# Altium schematic sheet 1_interface.schdoc: Interface
size A3; DrawnBy: André M. P. Mattos; SheetNumber: 1; SheetTotal: 6; DesignedBy: André M. P. Mattos; ProjectRevision: v0.1; Rule: PcbType=ProtelPcb
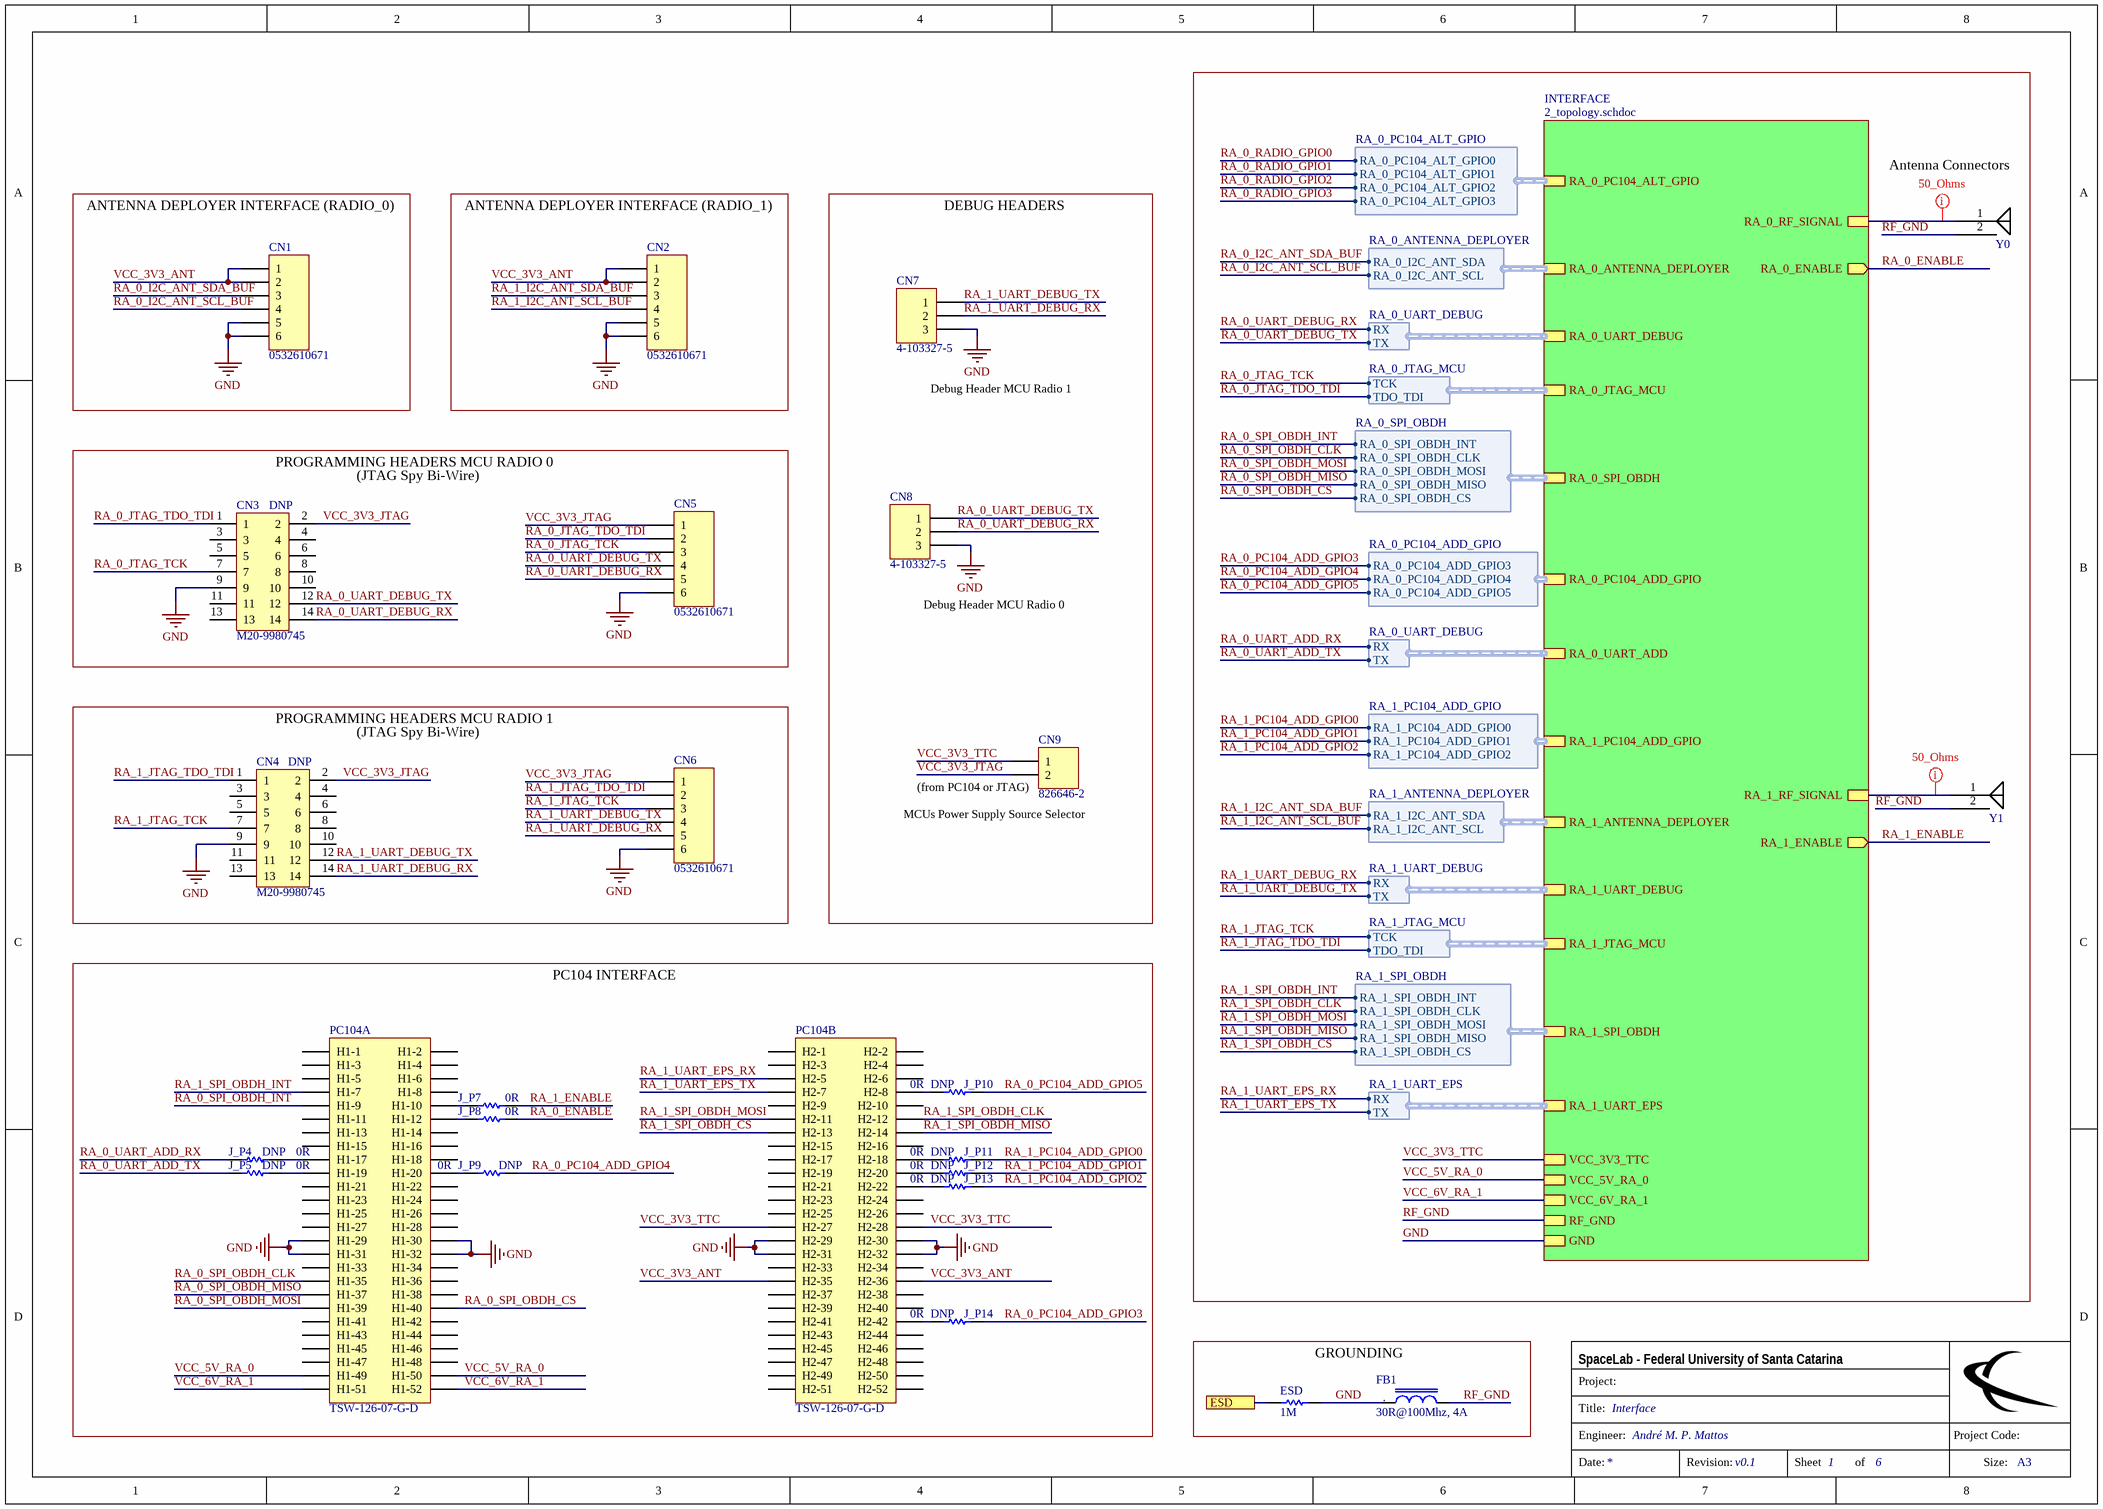
[diagram p0: 1_interface.schdoc]

## Parts
CN1  0532610671  [PICOBLADE 6PIN Right Angle]
CN2  0532610671  [PICOBLADE 6PIN Right Angle]
CN3  M20-9980745  [CONN HEADER VERT 14POS 2.54MM]
CN4  M20-9980745  [CONN HEADER VERT 14POS 2.54MM]
CN5  0532610671  [PICOBLADE 6PIN Right Angle]
CN6  0532610671  [PICOBLADE 6PIN Right Angle]
CN7  4-103327-5  [HDR 1X3]
CN8  4-103327-5  [HDR 1X3]
CN9  826646-2  [HDR 1X2]
ESD  1M  [0805]
FB1  30R@100Mhz, 4A  [IND0805]
J_P4  0R  [0805]
J_P5  0R  [0805]
J_P7  0R  [0805]
J_P8  0R  [0805]
J_P9  0R  [0805]
J_P10  0R  [0805]
J_P11  0R  [0805]
J_P12  0R  [0805]
J_P13  0R  [0805]
J_P14  0R  [0805]
PC104  TSW-126-07-G-D  [PC104_TTC]  (parts A,B of 2)
Y0  Coaxial_Connectors_90º  [CONN MCX JACK  R/A  50 OHM SMD]  (value not drawn)
Y1  Coaxial_Connectors_90º  [CONN MCX JACK  R/A  50 OHM SMD]  (value not drawn)

## Blocks framed on the sheet
Antenna Connectors: Y0 Y1
ANTENNA DEPLOYER INTERFACE (RADIO_0): CN1
ANTENNA DEPLOYER INTERFACE (RADIO_1): CN2
DEBUG HEADERS: CN7-CN9
PC104 INTERFACE: J_P4 J_P5 J_P7-J_P14 PC104
GROUNDING: ESD FB1

## Sub-sheets
INTERFACE = 2_topology.schdoc: RA_0_ANTENNA_DEPLOYER (harness RA_0_ANTENNA_DEPLOYER), RA_0_UART_DEBUG (harness RA_0_UART_DEBUG), RA_0_JTAG_MCU (harness RA_0_JTAG_MCU), RA_0_PC104_ALT_GPIO (harness RA_0_PC104_ALT_GPIO), RA_0_PC104_ADD_GPIO (harness RA_0_PC104_ADD_GPIO), RA_0_UART_ADD (harness RA_0_UART_DEBUG), RA_1_ANTENNA_DEPLOYER (harness RA_1_ANTENNA_DEPLOYER), RA_1_UART_DEBUG (harness RA_1_UART_DEBUG), RA_1_JTAG_MCU (harness RA_1_JTAG_MCU), RA_1_SPI_OBDH (harness RA_1_SPI_OBDH), RA_1_PC104_ADD_GPIO (harness RA_1_PC104_ADD_GPIO), RA_1_UART_EPS (harness RA_1_UART_EPS), RA_0_RF_SIGNAL, RA_1_RF_SIGNAL, RA_0_ENABLE (out), RA_1_ENABLE (out), VCC_3V3_TTC, VCC_5V_RA_0, VCC_6V_RA_1, RF_GND, GND, RA_0_SPI_OBDH (harness RA_0_SPI_OBDH)

## Ports
ESD

## Harnesses
RA_0_PC104_ALT_GPIO: RA_0_PC104_ALT_GPIO3, RA_0_PC104_ALT_GPIO2, RA_0_PC104_ALT_GPIO1, RA_0_PC104_ALT_GPIO0
RA_0_ANTENNA_DEPLOYER: RA_0_I2C_ANT_SCL, RA_0_I2C_ANT_SDA
RA_0_UART_DEBUG: TX, RX
RA_0_JTAG_MCU: TDO_TDI, TCK
RA_1_PC104_ADD_GPIO: RA_1_PC104_ADD_GPIO2, RA_1_PC104_ADD_GPIO1, RA_1_PC104_ADD_GPIO0
RA_1_ANTENNA_DEPLOYER: RA_1_I2C_ANT_SCL, RA_1_I2C_ANT_SDA
RA_1_UART_DEBUG: TX, RX
RA_1_JTAG_MCU: TDO_TDI, TCK
RA_1_SPI_OBDH: RA_1_SPI_OBDH_CLK, RA_1_SPI_OBDH_MOSI, RA_1_SPI_OBDH_MISO, RA_1_SPI_OBDH_CS, RA_1_SPI_OBDH_INT
RA_1_UART_EPS: TX, RX
RA_0_PC104_ADD_GPIO: RA_0_PC104_ADD_GPIO5, RA_0_PC104_ADD_GPIO4, RA_0_PC104_ADD_GPIO3
RA_0_SPI_OBDH: RA_0_SPI_OBDH_CLK, RA_0_SPI_OBDH_MOSI, RA_0_SPI_OBDH_MISO, RA_0_SPI_OBDH_CS, RA_0_SPI_OBDH_INT

## Nets
GND: CN1.5 CN1.6 CN2.5 CN2.6 CN3.9 CN4.9 CN5.6 CN6.6 CN7.3 CN8.3 ESD.1 FB1.1 PC104.H1-29 PC104.H1-30 PC104.H1-31 PC104.H1-32 PC104.H2-29 PC104.H2-30 PC104.H2-31 PC104.H2-32 ; sheet INTERFACE/GND
ESD: ESD.2 ; port ESD
RA_0_ENABLE: J_P8.1 ; sheet INTERFACE/RA_0_ENABLE
RA_0_I2C_ANT_SCL_BUF: CN1.4 ; sheet INTERFACE/RA_0_ANTENNA_DEPLOYER.RA_0_I2C_ANT_SCL
RA_0_I2C_ANT_SDA_BUF: CN1.3 ; sheet INTERFACE/RA_0_ANTENNA_DEPLOYER.RA_0_I2C_ANT_SDA
RA_0_JTAG_TCK: CN3.7 CN5.3 ; sheet INTERFACE/RA_0_JTAG_MCU.TCK
RA_0_JTAG_TDO_TDI: CN3.1 CN5.2 ; sheet INTERFACE/RA_0_JTAG_MCU.TDO_TDI
RA_0_PC104_ADD_GPIO3: J_P14.1 ; sheet INTERFACE/RA_0_PC104_ADD_GPIO.RA_0_PC104_ADD_GPIO3
RA_0_PC104_ADD_GPIO4: J_P9.1 ; sheet INTERFACE/RA_0_PC104_ADD_GPIO.RA_0_PC104_ADD_GPIO4
RA_0_PC104_ADD_GPIO5: J_P10.1 ; sheet INTERFACE/RA_0_PC104_ADD_GPIO.RA_0_PC104_ADD_GPIO5
RA_0_RADIO_GPIO0: sheet INTERFACE/RA_0_PC104_ALT_GPIO.RA_0_PC104_ALT_GPIO0
RA_0_RADIO_GPIO1: sheet INTERFACE/RA_0_PC104_ALT_GPIO.RA_0_PC104_ALT_GPIO1
RA_0_RADIO_GPIO2: sheet INTERFACE/RA_0_PC104_ALT_GPIO.RA_0_PC104_ALT_GPIO2
RA_0_RADIO_GPIO3: sheet INTERFACE/RA_0_PC104_ALT_GPIO.RA_0_PC104_ALT_GPIO3
RA_0_SPI_OBDH_CLK: PC104.H1-35 ; sheet INTERFACE/RA_0_SPI_OBDH.RA_0_SPI_OBDH_CLK
RA_0_SPI_OBDH_CS: PC104.H1-40 ; sheet INTERFACE/RA_0_SPI_OBDH.RA_0_SPI_OBDH_CS
RA_0_SPI_OBDH_INT: PC104.H1-9 ; sheet INTERFACE/RA_0_SPI_OBDH.RA_0_SPI_OBDH_INT
RA_0_SPI_OBDH_MISO: PC104.H1-37 ; sheet INTERFACE/RA_0_SPI_OBDH.RA_0_SPI_OBDH_MISO
RA_0_SPI_OBDH_MOSI: PC104.H1-39 ; sheet INTERFACE/RA_0_SPI_OBDH.RA_0_SPI_OBDH_MOSI
RA_0_UART_ADD_RX: J_P4.2 ; sheet INTERFACE/RA_0_UART_ADD.RX
RA_0_UART_ADD_TX: J_P5.2 ; sheet INTERFACE/RA_0_UART_ADD.TX
RA_0_UART_DEBUG_RX: CN3.14 CN5.5 CN8.2 ; sheet INTERFACE/RA_0_UART_DEBUG.RX
RA_0_UART_DEBUG_TX: CN3.12 CN5.4 CN8.1 ; sheet INTERFACE/RA_0_UART_DEBUG.TX
RA_1_ENABLE: J_P7.1 ; sheet INTERFACE/RA_1_ENABLE
RA_1_I2C_ANT_SCL_BUF: CN2.4 ; sheet INTERFACE/RA_1_ANTENNA_DEPLOYER.RA_1_I2C_ANT_SCL
RA_1_I2C_ANT_SDA_BUF: CN2.3 ; sheet INTERFACE/RA_1_ANTENNA_DEPLOYER.RA_1_I2C_ANT_SDA
RA_1_JTAG_TCK: CN4.7 CN6.3 ; sheet INTERFACE/RA_1_JTAG_MCU.TCK
RA_1_JTAG_TDO_TDI: CN4.1 CN6.2 ; sheet INTERFACE/RA_1_JTAG_MCU.TDO_TDI
RA_1_PC104_ADD_GPIO0: J_P11.1 ; sheet INTERFACE/RA_1_PC104_ADD_GPIO.RA_1_PC104_ADD_GPIO0
RA_1_PC104_ADD_GPIO1: J_P12.1 ; sheet INTERFACE/RA_1_PC104_ADD_GPIO.RA_1_PC104_ADD_GPIO1
RA_1_PC104_ADD_GPIO2: J_P13.1 ; sheet INTERFACE/RA_1_PC104_ADD_GPIO.RA_1_PC104_ADD_GPIO2
RA_1_SPI_OBDH_CLK: PC104.H2-12 ; sheet INTERFACE/RA_1_SPI_OBDH.RA_1_SPI_OBDH_CLK
RA_1_SPI_OBDH_CS: PC104.H2-13 ; sheet INTERFACE/RA_1_SPI_OBDH.RA_1_SPI_OBDH_CS
RA_1_SPI_OBDH_INT: PC104.H1-7 ; sheet INTERFACE/RA_1_SPI_OBDH.RA_1_SPI_OBDH_INT
RA_1_SPI_OBDH_MISO: PC104.H2-14 ; sheet INTERFACE/RA_1_SPI_OBDH.RA_1_SPI_OBDH_MISO
RA_1_SPI_OBDH_MOSI: PC104.H2-11 ; sheet INTERFACE/RA_1_SPI_OBDH.RA_1_SPI_OBDH_MOSI
RA_1_UART_DEBUG_RX: CN4.14 CN6.5 CN7.2 ; sheet INTERFACE/RA_1_UART_DEBUG.RX
RA_1_UART_DEBUG_TX: CN4.12 CN6.4 CN7.1 ; sheet INTERFACE/RA_1_UART_DEBUG.TX
RA_1_UART_EPS_RX: PC104.H2-5 ; sheet INTERFACE/RA_1_UART_EPS.RX
RA_1_UART_EPS_TX: PC104.H2-7 ; sheet INTERFACE/RA_1_UART_EPS.TX
RF_GND: FB1.2 Y0.2 Y1.2 ; sheet INTERFACE/RF_GND
VCC_3V3_ANT: CN1.1 CN1.2 CN2.1 CN2.2 PC104.H2-35 PC104.H2-36
VCC_3V3_JTAG: CN3.2 CN4.2 CN5.1 CN6.1 CN9.2
VCC_3V3_TTC: CN9.1 PC104.H2-27 PC104.H2-28 ; sheet INTERFACE/VCC_3V3_TTC
VCC_5V_RA_0: PC104.H1-49 PC104.H1-50 ; sheet INTERFACE/VCC_5V_RA_0
VCC_6V_RA_1: PC104.H1-51 PC104.H1-52 ; sheet INTERFACE/VCC_6V_RA_1
NetJ_P4_1: J_P4.1 PC104.H1-17
NetJ_P5_1: J_P5.1 PC104.H1-19
NetJ_P7_2: J_P7.2 PC104.H1-10
NetJ_P8_2: J_P8.2 PC104.H1-12
NetJ_P9_2: J_P9.2 PC104.H1-20
NetJ_P10_2: J_P10.2 PC104.H2-8
NetJ_P11_2: J_P11.2 PC104.H2-18
NetJ_P12_2: J_P12.2 PC104.H2-20
NetJ_P13_2: J_P13.2 PC104.H2-22
NetJ_P14_2: J_P14.2 PC104.H2-42
NetY0_1: Y0.1 ; sheet INTERFACE/RA_0_RF_SIGNAL
NetY1_1: Y1.1 ; sheet INTERFACE/RA_1_RF_SIGNAL

Not connected (* = marked no-connect by the designer): CN3 3 4 5 6 8 10 11 13; CN4 3 4 5 6 8 10 11 13; PC104 H1-1 H1-2 H1-3 H1-4 H1-5 H1-6 H1-8 H1-11 H1-13 H1-14 H1-15 H1-16 H1-18 H1-21 H1-22 H1-23 H1-24 H1-25 H1-26 H1-27 H1-28 H1-33 H1-34 H1-36 H1-38 H1-41 H1-42 H1-43 H1-44 H1-45 H1-46 H1-47 H1-48 H2-1 H2-2 H2-3 H2-4 H2-6 H2-9 H2-10 H2-15 H2-16 H2-17 H2-19 H2-21 H2-23 H2-24 H2-25 H2-26 H2-33 H2-34 H2-37 H2-38 H2-39 H2-40 H2-41 H2-43 H2-44 H2-45 H2-46 H2-47 H2-48 H2-49 H2-50 H2-51 H2-52

## Layout directives
net class 50Ohm_Net: NetY0_1, NetY1_1

## Notes on the sheet
- Debug Header MCU Radio 1
- (near CN3) DNP
- (near CN3) PROGRAMMING HEADERS MCU RADIO 0
- (JTAG Spy Bi-Wire)
- Debug Header MCU Radio 0
- (near CN4) PROGRAMMING HEADERS MCU RADIO 1
- (near CN4) DNP
- (near CN9) MCUs Power Supply Source Selector
- (near CN9) (from PC104 or JTAG)
- (near J_P10) DNP
- (near J_P4) DNP
- DNP
- (near J_P9) DNP
- (near J_P11) DNP
- (near J_P14) DNP
- Project:
- SpaceLab - Federal University of Santa Catarina
- Title:
- Engineer:
- Project Code:
- Date:
- Revision:
- Sheet
- of
- Size:
- A3
- (in symbol FB_30R_4A_100MHz_0805) .

## Library data of the parts
CN1 CN2 CN5 CN6 = 0532610671: PicoBlade 6 Position Right Angle Connector Header Surface Mount  0.049" (1.25mm); LatestRevisionDate: 17-Jul-2002; LatestRevisionNote: Re-released for DXP Platform.; Publisher: Altium Limited; Partnumber: 0532610671
CN3 CN4 = M20-9980745: Connector Header Through Hole 14 position 0.100" (2.54mm); Manufacturer: Harwin; Number of Contacts: 14; Contact Resistance: 25mR; Max Current Rating: 3A; Gender: Male; Connector Type: Male Pin; Row Spacing: 0.1inch; Supplier 1: Digi-Key; Supplier Part Number 1: 952-1932-ND; Stock 1: 15564; Pricing 1: 1=0.54, 10=0.51, 100=0.391, 500=0.34, 1000=0.2805, 5000=0.2465, 10000=0.2295 (USD); Mount: Through Hole; Contact Plating: Gold; Contact Material: Brass; Color: Black; Housing Color: Black; Housing Material: Nylon; Min Operating Temperature: -40°C; Max Operating Temperature: 105°C; Number of Rows: 2; Termination: Solder; Package Quantity: 500; Packaging: Bag; Number of Positions: 14; Orientation: Straight; Length: 17.78mm; Pitch: 2.54mm; Contact Mating Length: 0.24inch; Depth: 5.08mm; Radiation Hardening: No; REACH SVHC: No SVHC; ComponentLink1URL: https://www.verical.com/server-webapp/html/getDatasheet?partID=468550&src-supplier=Verical; ComponentLink1Description: https://www.verical.com/server-webapp/html/getDatasheet?partID=468550&src-supplier=Verical; ComponentLink2URL: http://www.harwin.com/include/downloads/drawings/M20-998.PDF?src-supplier=Element14; ComponentLink2Description: http://www.harwin.com/include/downloads/drawings/M20-998.PDF?src-supplier=Element14; ComponentLink3URL: http://www.mouser.com/ds/2/181/M20-998-351176.pdf?src-supplier=Mouser; ComponentLink3Description: http://www.mouser.com/ds/2/181/M20-998-351176.pdf?src-supplier=Mouser; Supplier 2: Mouser; Supplier Part Number 2: 855-M20-9980745; Stock 2: 1790; Pricing 2: 1=0.54, 10=0.51, 100=0.387, 500=0.34, 1000=0.28, 2500=0.246 (USD); Manufacturer Part Number: M20-9980745
CN7 CN8 = 4-103327-5: Connector Header Through Hole 3 position 0.100" (2.54mm); Manufacturer: TE Connectivity AMP; Number of Contacts: 3; Connector Type: Plug,Header,Pin; Current Rating: 3A; Insulation Resistance: 5GR; Board Standoff: No (Without); High Speed Serial Data Connector: No; PCB Mount Retention: Without; PCB Mounting Orientation: Vertical; Contact Post Length: 0.12inch; Approvals: CSA; Fitted: Yes (eng model only); LatestRevisionDate: 17-Jul-2002; LatestRevisionNote: Re-released for DXP Platform.; Publisher: Altium Limited; Partnumber: 4-103327-5; Supplier 1: Mouser; Supplier Part Number 1: 571-4-103327-5; Stock 1: 2961; Pricing 1: 1=0.26, 10=0.182, 100=0.157, 500=0.15, 1000=0.125, 2500=0.107 (USD); Mount: Through Hole; Contact Plating: Tin; Contact Material: Bronze; Housing Color: Black; Housing Material: Thermoplastic; Contact Shape: Square; Min Operating Temperature: -65°C; Max Operating Temperature: 105°C; Number of Rows: 1; Termination: Through Hole; Packaging: Carton; Package Quantity: 540; Number of Positions: 3; Contact Gender: Male; Orientation: Straight; Contact Protection: No (Without); Gasket: No (Without); High Temperature Housing: No; Keyed: No; Mating Connector Lock: No (Without); Selectively Loaded: No (Without); Stabilizers: No (Without); Strain Relief: No (Without); Contact Current Rating: 3A; Length: 7.21mm; Pitch: 2.54mm; Contact Mating Length: 0.23inch; Row Spacing: 2.54mm; Depth: 2.34mm; Radiation Hardening: No; ELV: Compliant; Flammability Rating: UL94 V-0; Supplier 2: Digi-Key; Supplier Part Number 2: A128778-ND; Stock 2: 16328; Pricing 2: 1=0.26, 10=0.25, 100=0.1753, 500=0.1503, 1000=0.12525, 5000=0.10736, 10000=0.1002 (USD); Manufacturer Part Number: 4-103327-5
CN9 = 826646-2: Connector Header Through Hole 2 position 0.100" (2.54mm); LatestRevisionDate: 17-Jul-2002; LatestRevisionNote: Re-released for DXP Platform.; Publisher: Altium Limited; PartNumber: 826646-2
ESD = R1000k_1%_1/8W_0805: RES 1000K OHM 1/8W 1% 0805; Partnumber: RMCF0805FG1M00; NCM: 8533.21.20
FB1 = FB_30R_4A_100MHz_0805: Ferrite Bead 30 OHM 4A 100MHz; Partnumber: BLM21PG300SN1D; NCM: 8504.50.00
J_P4 J_P5 J_P7-J_P14 = R0R_JUMPER_1/8W_0805: RES 0R OHM 1/8W JUMPER 0805; Partnumber: CRCW08050000Z0EA; NCM: 8533.21.20
PC104 = PC104_TTC: Connector Header Through Hole 52 position 0.100" (2.54mm) - PC104 used in the TTC module; Partnumber: SSW-126-04-G-D; Contact Length - Mating: 5.84mm; Overall Contact Length: 10.92mm; Contact Length - Post: 2.54mm; Insulation Height: 2.54mm; Contact Finish - Mating: Gold; Operating Temperature: -55°C ~ 125°C
Y0 Y1 = Coaxial_Connectors_90º: MCX Connector Jack, Female Socket 50Ohm Through Hole, Right Angle Solder; Partnumber: 133-3701-311